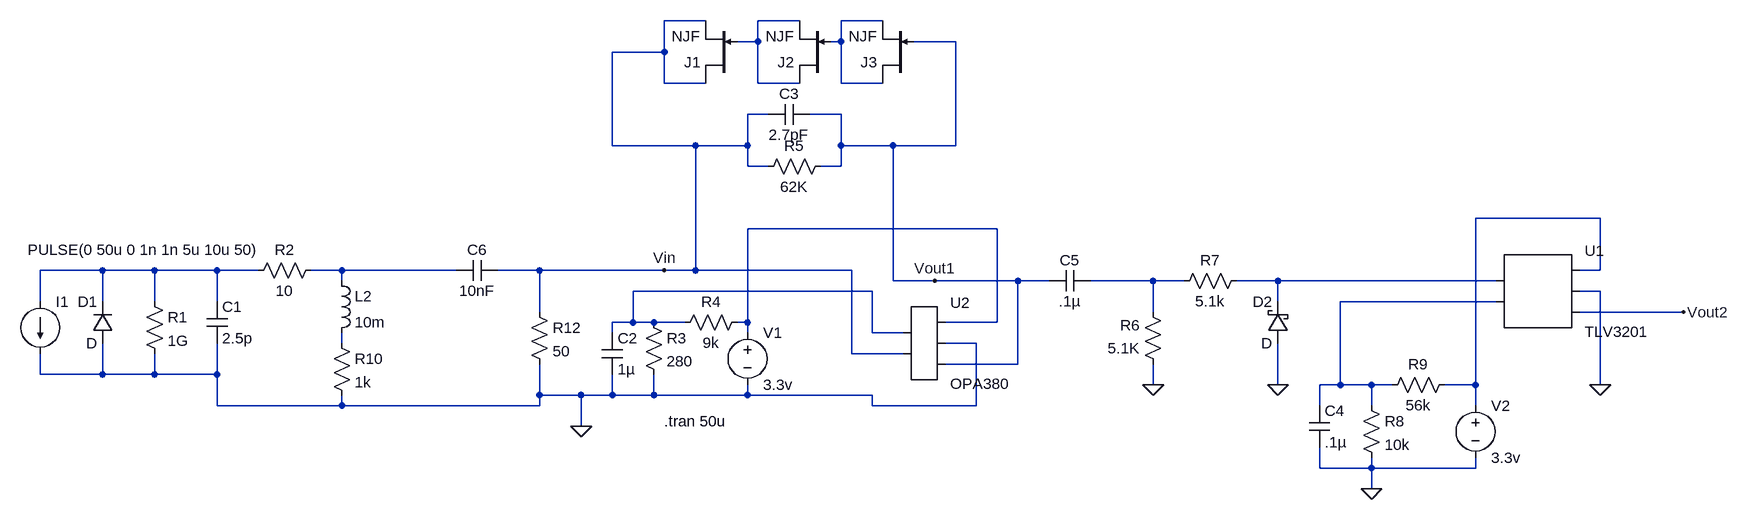
[diagram p0: schematic reciever design.asc]
reciever design.asc, the LTspice schematic file:
Version 4
SHEET 1 1616 680
WIRE 32 -80 -32 -80
WIRE 176 -80 112 -80
WIRE 304 -80 240 -80
WIRE 112 -48 112 -80
WIRE 112 -48 80 -48
WIRE 240 -48 240 -80
WIRE 240 -48 224 -48
WIRE 416 -48 352 -48
WIRE -32 -32 -32 -80
WIRE -32 -32 -112 -32
WIRE -32 16 -32 -32
WIRE 32 16 -32 16
WIRE 112 16 112 -48
WIRE 176 16 112 16
WIRE 240 16 240 -48
WIRE 304 16 240 16
WIRE 128 64 96 64
WIRE 240 64 192 64
WIRE -112 112 -112 -32
WIRE 16 112 -112 112
WIRE 96 112 96 64
WIRE 96 112 16 112
WIRE 240 112 240 64
WIRE 320 112 240 112
WIRE 416 112 416 -48
WIRE 416 112 320 112
WIRE 96 144 96 112
WIRE 128 144 96 144
WIRE 240 144 240 112
WIRE 240 144 208 144
WIRE 1408 224 1216 224
WIRE 480 240 96 240
WIRE -896 304 -992 304
WIRE -816 304 -896 304
WIRE -720 304 -816 304
WIRE -656 304 -720 304
WIRE -528 304 -576 304
WIRE -352 304 -528 304
WIRE -224 304 -288 304
WIRE -32 304 -224 304
WIRE 16 304 16 112
WIRE 16 304 -32 304
WIRE 256 304 16 304
WIRE 1408 304 1408 224
WIRE 1408 304 1376 304
WIRE -528 320 -528 304
WIRE 320 320 320 112
WIRE 384 320 320 320
WIRE 512 320 384 320
WIRE 560 320 512 320
WIRE 720 320 624 320
WIRE 768 320 720 320
WIRE 912 320 848 320
WIRE 1248 320 912 320
WIRE 288 336 -80 336
WIRE 1408 336 1376 336
WIRE -992 352 -992 304
WIRE -896 352 -896 304
WIRE -816 352 -816 304
WIRE -720 352 -720 304
WIRE 912 352 912 320
WIRE 1248 352 1008 352
WIRE -224 368 -224 304
WIRE 720 368 720 320
WIRE 1536 368 1376 368
WIRE -80 384 -80 336
WIRE -80 384 -112 384
WIRE -48 384 -80 384
WIRE 0 384 -48 384
WIRE 96 384 96 240
WIRE 96 384 80 384
WIRE 480 384 480 240
WIRE 480 384 400 384
WIRE -112 400 -112 384
WIRE 96 400 96 384
WIRE 288 400 288 336
WIRE 336 400 288 400
WIRE -528 416 -528 400
WIRE 448 416 400 416
WIRE 256 432 256 304
WIRE 336 432 256 432
WIRE 512 448 512 320
WIRE 512 448 400 448
WIRE -992 464 -992 432
WIRE -896 464 -896 416
WIRE -896 464 -992 464
WIRE -816 464 -816 432
WIRE -816 464 -896 464
WIRE -720 464 -720 416
WIRE -720 464 -816 464
WIRE 720 480 720 448
WIRE 912 480 912 416
WIRE 1008 480 1008 352
WIRE 1008 480 976 480
WIRE 1056 480 1008 480
WIRE 1088 480 1056 480
WIRE 1216 480 1216 224
WIRE 1216 480 1168 480
WIRE 1408 480 1408 336
WIRE -224 496 -224 448
WIRE -160 496 -224 496
WIRE -112 496 -112 464
WIRE -112 496 -160 496
WIRE -48 496 -48 464
WIRE -48 496 -112 496
WIRE 96 496 96 480
WIRE 96 496 -48 496
WIRE 288 496 96 496
WIRE -720 512 -720 464
WIRE -528 512 -528 496
WIRE -528 512 -720 512
WIRE -224 512 -224 496
WIRE -224 512 -528 512
WIRE 288 512 288 496
WIRE 448 512 448 416
WIRE 448 512 288 512
WIRE 976 512 976 480
WIRE 1056 512 1056 480
WIRE 1216 512 1216 480
WIRE -160 544 -160 496
WIRE 976 608 976 576
WIRE 1056 608 1056 592
WIRE 1056 608 976 608
WIRE 1216 608 1216 592
WIRE 1216 608 1056 608
WIRE 1056 640 1056 608
FLAG 384 320 Vout1
FLAG -32 304 Vin
FLAG -160 544 0
FLAG 720 480 0
FLAG 1408 480 0
FLAG 1056 640 0
FLAG 912 480 0
FLAG 1536 368 Vout2
SYMBOL res -832 336 R0
SYMATTR InstName R1
SYMATTR Value 1G
SYMBOL cap -736 352 R0
SYMATTR InstName C1
SYMATTR Value 2.5p
SYMBOL res -560 288 R90
WINDOW 0 0 56 VBottom 2
WINDOW 3 32 56 VTop 2
SYMATTR InstName R2
SYMATTR Value 10
SYMBOL current -992 352 R0
WINDOW 3 -19 -80 Left 2
SYMATTR Value PULSE(0 50u 0 1n 1n 5u 10u 50)
SYMATTR InstName I1
SYMATTR Value2 AC 0 0
SYMBOL diode -880 416 R180
WINDOW 0 24 64 Left 2
WINDOW 3 24 0 Left 2
SYMATTR InstName D1
SYMBOL Res -64 368 R0
SYMATTR InstName R3
SYMATTR Value 280
SYMBOL Res 96 368 R90
WINDOW 0 0 56 VBottom 2
WINDOW 3 32 56 VTop 2
SYMATTR InstName R4
SYMATTR Value 9k
SYMBOL Cap -128 400 R0
SYMATTR InstName C2
SYMATTR Value 1µ
SYMBOL voltage 96 384 R0
SYMATTR InstName V1
SYMATTR Value 3.3v
SYMBOL Res 224 128 R90
WINDOW 0 0 56 VBottom 2
WINDOW 3 32 56 VTop 2
SYMATTR InstName R5
SYMATTR Value 62K
SYMBOL Cap 192 48 R90
WINDOW 0 0 32 VBottom 2
WINDOW 3 32 32 VTop 2
SYMATTR InstName C3
SYMATTR Value 2.7pF
SYMBOL njf 80 16 R180
SYMATTR InstName J1
SYMBOL njf 224 16 R180
SYMATTR InstName J2
SYMBOL njf 352 16 R180
SYMATTR InstName J3
SYMBOL Res 736 464 R180
WINDOW 0 36 76 Left 2
WINDOW 3 36 40 Left 2
SYMATTR InstName R6
SYMATTR Value 5.1K
SYMBOL Res 864 304 R90
WINDOW 0 0 56 VBottom 2
WINDOW 3 32 56 VTop 2
SYMATTR InstName R7
SYMATTR Value 5.1k
SYMBOL schottky 928 416 R180
WINDOW 0 24 64 Left 2
WINDOW 3 24 0 Left 2
SYMATTR InstName D2
SYMBOL AutoGenerated/TLV3201 1312 336 R0
SYMATTR InstName U1
SYMBOL Cap 960 512 R0
SYMATTR InstName C4
SYMATTR Value .1µ
SYMBOL Res 1040 496 R0
SYMATTR InstName R8
SYMATTR Value 10k
SYMBOL Voltage 1216 496 R0
SYMATTR InstName V2
SYMATTR Value 3.3v
SYMBOL Res 1184 464 R90
WINDOW 0 0 56 VBottom 2
WINDOW 3 32 56 VTop 2
SYMATTR InstName R9
SYMATTR Value 56k
SYMBOL Cap 624 304 R90
WINDOW 0 0 32 VBottom 2
WINDOW 3 32 32 VTop 2
SYMATTR InstName C5
SYMATTR Value .1µ
SYMBOL AutoGenerated/OPA380 368 416 R0
SYMATTR InstName U2
SYMBOL ind -544 304 R0
SYMATTR InstName L2
SYMATTR Value 10m
SYMBOL Res -544 400 R0
SYMATTR InstName R10
SYMATTR Value 1k
SYMBOL Res -240 352 R0
SYMATTR InstName R12
SYMATTR Value 50
SYMBOL Cap -288 288 R90
WINDOW 0 0 32 VBottom 2
WINDOW 3 32 32 VTop 2
SYMATTR InstName C6
SYMATTR Value 10nF
TEXT -32 536 Left 2 !.tran 50u

The netlist it stands for:
* reciever design.asc
R1 N005 0 1G
C1 N005 0 2.5p
R2 N006 N005 10
I1 N005 0 PULSE(0 50u 0 1n 1n 5u 10u 50) AC 0 0
D1 0 N005 D
R3 N009 0 280
R4 N004 N009 9k
C2 N009 0 1µ
V1 N004 0 3.3v
R5 Vout1 Vin 62K
C3 Vout1 Vin 2.7pF
J1 Vin N001 Vin NJF
J2 N001 N002 N001 NJF
J3 N002 Vout1 N002 NJF
R6 0 N007 5.1K
R7 N008 N007 5.1k
D2 0 N008 D
* U1: TLV3201 (symbol AutoGenerated/TLV3201 not available, pins judged from their places): pin1=N008 pin2=N010 pin3=N003 pin4=0 pin5=Vout2
C4 N010 0 .1µ
R8 N010 0 10k
V2 N003 0 3.3v
R9 N003 N010 56k
C5 N007 Vout1 .1µ
* U2: OPA380 (symbol AutoGenerated/OPA380 not available, pins judged from their places): pin1=N009 pin2=Vin pin3=N004 pin4=0 pin5=Vout1
L2 N006 N011 10m
R10 N011 0 1k
R12 Vin 0 50
C6 Vin N006 10nF
.model D D
.lib standard.dio
.model NJF NJF
.model PJF PJF
.lib standard.jft
.tran 50u
.backanno
.end